# Altium schematic sheet FPGA_Project1.SchDoc
size A4
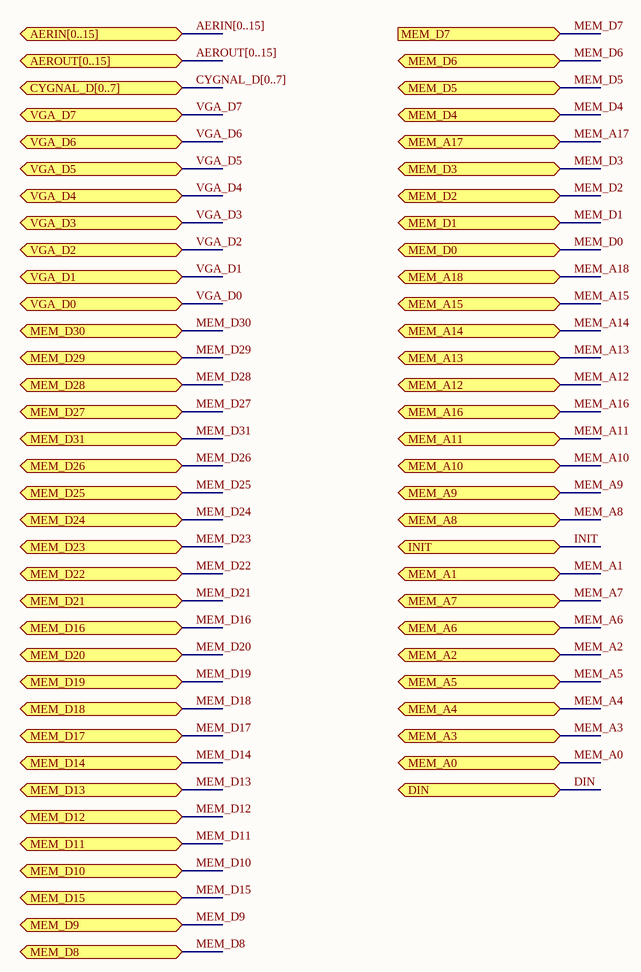
[diagram p0: FPGA_Project1.SchDoc]

## Ports
AERIN[0..15] (bidir), AEROUT[0..15] (bidir), CYGNAL_D[0..7] (bidir), DIN (bidir), INIT (bidir), MEM_A0 (bidir), MEM_A1 (bidir), MEM_A2 (bidir), MEM_A3 (bidir), MEM_A4 (bidir), MEM_A5 (bidir), MEM_A6 (bidir), MEM_A7 (bidir), MEM_A8 (bidir), MEM_A9 (bidir), MEM_A10 (bidir), MEM_A11 (bidir), MEM_A12 (bidir), MEM_A13 (bidir), MEM_A14 (bidir), MEM_A15 (bidir), MEM_A16 (bidir), MEM_A17 (bidir), MEM_A18 (bidir), MEM_D0 (bidir), MEM_D1 (bidir), MEM_D2 (bidir), MEM_D3 (bidir), MEM_D4 (bidir), MEM_D5 (bidir), MEM_D6 (bidir), MEM_D7 (in), MEM_D8 (bidir), MEM_D9 (bidir), MEM_D10 (bidir), MEM_D11 (bidir), MEM_D12 (bidir), MEM_D13 (bidir), MEM_D14 (bidir), MEM_D15 (bidir), MEM_D16 (bidir), MEM_D17 (bidir), MEM_D18 (bidir), MEM_D19 (bidir), MEM_D20 (bidir), MEM_D21 (bidir), MEM_D22 (bidir), MEM_D23 (bidir), MEM_D24 (bidir), MEM_D25 (bidir), MEM_D26 (bidir), MEM_D27 (bidir), MEM_D28 (bidir), MEM_D29 (bidir), MEM_D30 (bidir), MEM_D31 (bidir), VGA_D0 (bidir), VGA_D1 (bidir), VGA_D2 (bidir), VGA_D3 (bidir), VGA_D4 (bidir), VGA_D5 (bidir), VGA_D6 (bidir), VGA_D7 (bidir)

## Nets
DIN: port DIN
INIT: port INIT
MEM_A0: port MEM_A0
MEM_A1: port MEM_A1
MEM_A2: port MEM_A2
MEM_A3: port MEM_A3
MEM_A4: port MEM_A4
MEM_A5: port MEM_A5
MEM_A6: port MEM_A6
MEM_A7: port MEM_A7
MEM_A8: port MEM_A8
MEM_A9: port MEM_A9
MEM_A10: port MEM_A10
MEM_A11: port MEM_A11
MEM_A12: port MEM_A12
MEM_A13: port MEM_A13
MEM_A14: port MEM_A14
MEM_A15: port MEM_A15
MEM_A16: port MEM_A16
MEM_A17: port MEM_A17
MEM_A18: port MEM_A18
MEM_D0: port MEM_D0
MEM_D1: port MEM_D1
MEM_D2: port MEM_D2
MEM_D3: port MEM_D3
MEM_D4: port MEM_D4
MEM_D5: port MEM_D5
MEM_D6: port MEM_D6
MEM_D7: port MEM_D7
MEM_D8: port MEM_D8
MEM_D9: port MEM_D9
MEM_D10: port MEM_D10
MEM_D11: port MEM_D11
MEM_D12: port MEM_D12
MEM_D13: port MEM_D13
MEM_D14: port MEM_D14
MEM_D15: port MEM_D15
MEM_D16: port MEM_D16
MEM_D17: port MEM_D17
MEM_D18: port MEM_D18
MEM_D19: port MEM_D19
MEM_D20: port MEM_D20
MEM_D21: port MEM_D21
MEM_D22: port MEM_D22
MEM_D23: port MEM_D23
MEM_D24: port MEM_D24
MEM_D25: port MEM_D25
MEM_D26: port MEM_D26
MEM_D27: port MEM_D27
MEM_D28: port MEM_D28
MEM_D29: port MEM_D29
MEM_D30: port MEM_D30
MEM_D31: port MEM_D31
VGA_D0: port VGA_D0
VGA_D1: port VGA_D1
VGA_D2: port VGA_D2
VGA_D3: port VGA_D3
VGA_D4: port VGA_D4
VGA_D5: port VGA_D5
VGA_D6: port VGA_D6
VGA_D7: port VGA_D7

## Buses and harness runs
bus AERIN[0..15] = port AERIN[0..15]
bus AEROUT[0..15] = port AEROUT[0..15]
bus CYGNAL_D[0..7] = port CYGNAL_D[0..7]